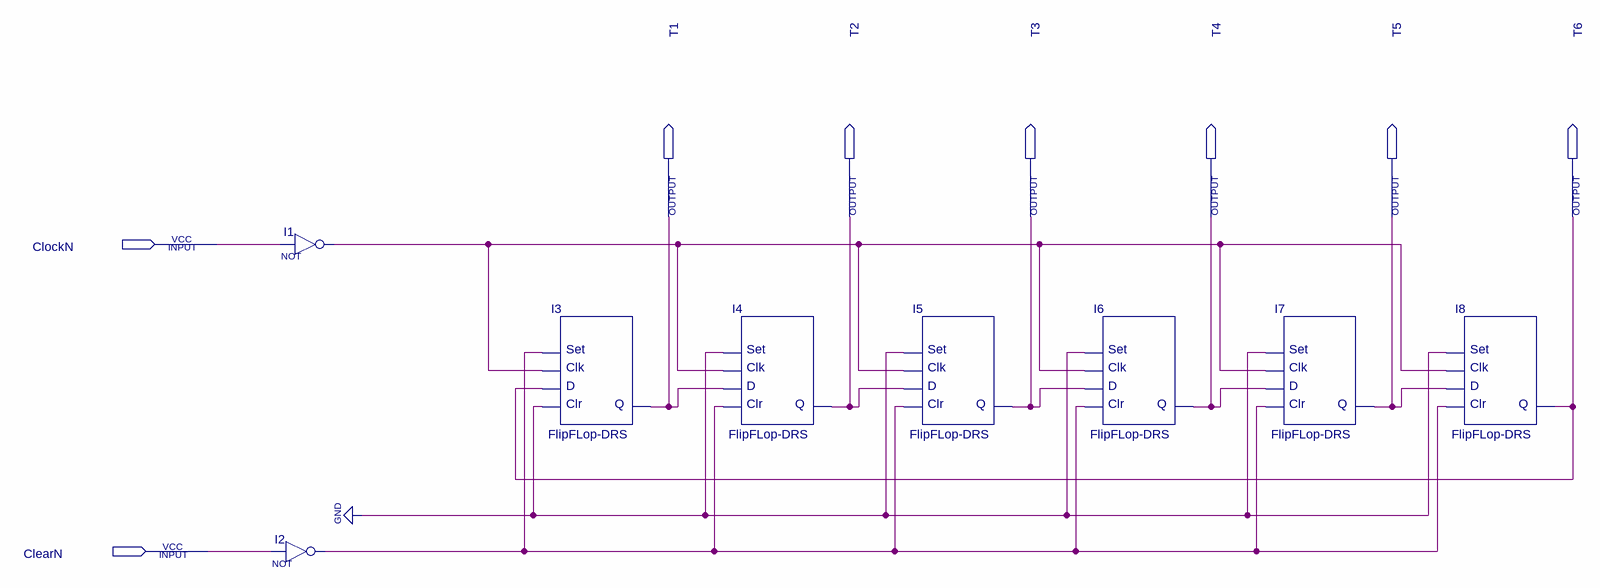
[diagram p0: schematic sheet]
// Quartus schematic Contador-Anel.bdf as structural Verilog: 8 symbols, 8 pins
module \Contador-Anel  (
  input  ClockN,
  input  ClearN,
  output T1,
  output T2,
  output T3,
  output T4,
  output T5,
  output T6
);

  wire I1_out, I2_out;

  not I1 (I1_out, ClockN);
  not I2 (I2_out, ClearN);
  \FlipFLop-DRS  I3 (.Clr(1'b0), .D(T6), .Clk(I1_out), .Set(I2_out), .Q(T1));
  \FlipFLop-DRS  I4 (.Clr(I2_out), .D(T1), .Clk(I1_out), .Set(1'b0), .Q(T2));
  \FlipFLop-DRS  I5 (.Clr(I2_out), .D(T2), .Clk(I1_out), .Set(1'b0), .Q(T3));
  \FlipFLop-DRS  I6 (.Clr(I2_out), .D(T3), .Clk(I1_out), .Set(1'b0), .Q(T4));
  \FlipFLop-DRS  I7 (.Clr(I2_out), .D(T4), .Clk(I1_out), .Set(1'b0), .Q(T5));
  \FlipFLop-DRS  I8 (.Clr(I2_out), .D(T5), .Clk(I1_out), .Set(1'b0), .Q(T6));
endmodule
